# Altium project ESP32 Relay Card.PrjPcb
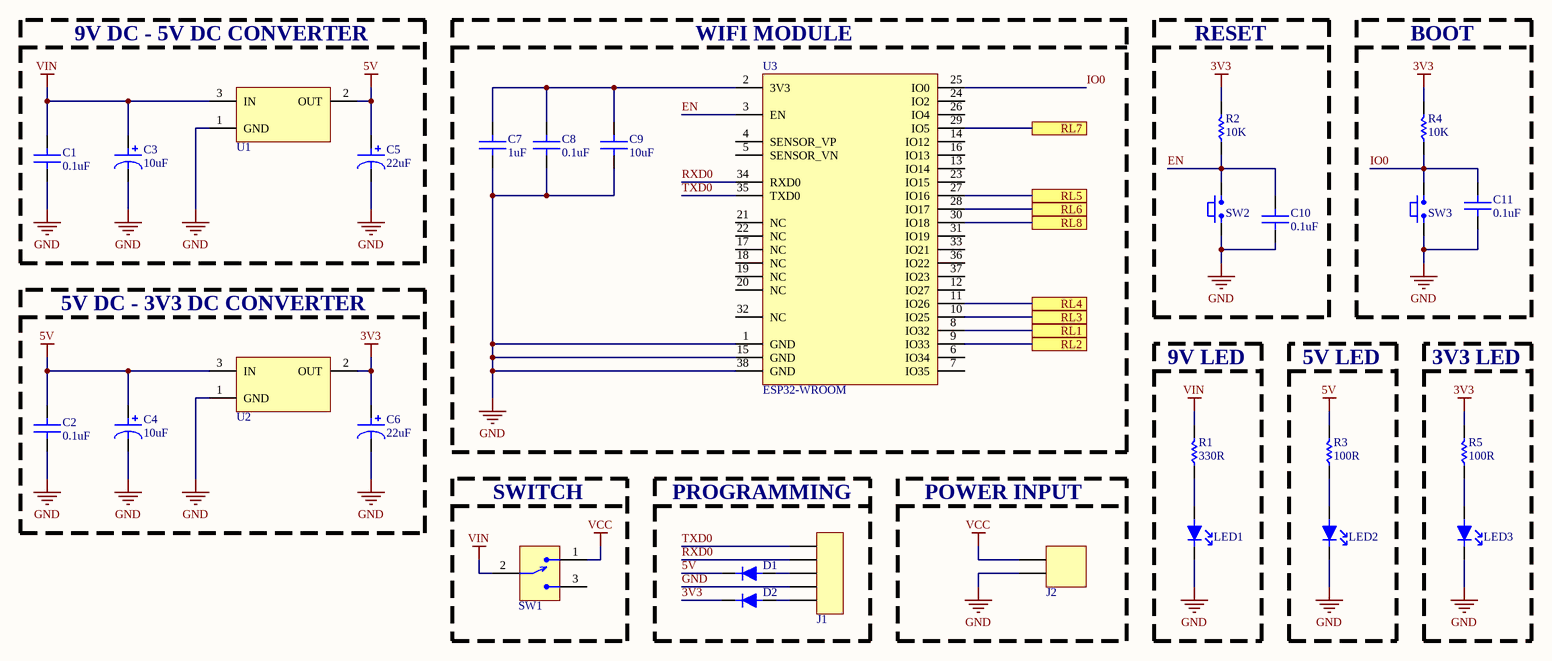
[diagram p0: ESP32 Relay Card Power.SchDoc]
2 sheets, 109 parts. Net scope: flat (ports and power ports of the same name join across sheets).
Board file: ESP32 Relay Card.PcbDoc
Sheets:
  ESP32 Relay Card Power.SchDoc
  ESP32 Relay Card Relay.SchDoc

## Sheet ESP32 Relay Card Power.SchDoc
size A3; SheetNumber: 1; SheetTotal: 2

### Parts
C1  value 0.1uF  [CAP 0805]  (hidden comment: CC0805KRX7R9BB104)
C2  value 0.1uF  [CAP 0805]  (hidden comment: CC0805KRX7R9BB104)
C3  value 10uF  [CAP ALUM 10UF]  (hidden comment: 875105359001)
C4  value 10uF  [CAP ALUM 10UF]  (hidden comment: 875105359001)
C5  value 22uF  [CAP ALUM 22UF]  (hidden comment: A766EB226M1DLAE060)
C6  value 22uF  [CAP ALUM 22UF]  (hidden comment: A766EB226M1DLAE060)
C7  value 1uF  [CAP 0805]  (hidden comment: CC0805KKX7R9BB105)
C8  value 0.1uF  [CAP 0805]  (hidden comment: CC0805KRX7R9BB104)
C9  value 10uF  [CAP 0805]  (hidden comment: CC0805KKX5R8BB106)
C10  value 0.1uF  [CAP 0805]  (hidden comment: CC0805KRX7R9BB104)
C11  value 0.1uF  [CAP 0805]  (hidden comment: CC0805KRX7R9BB104)
D1  1N5819W  [SOD-123F]  (value not drawn)
D2  1N5819W  [SOD-123F]  (value not drawn)
J1  61300511121  [HEADER]  (value not drawn)
J2  TB006-508-02BE  [2POS CONNECTOR]  (value not drawn)
LED1  150080VS75000  [LED 0805 SMD]  (value not drawn)
LED2  150080VS75000  [LED 0805 SMD]  (value not drawn)
LED3  150080VS75000  [LED 0805 SMD]  (value not drawn)
R1  value 330R  [RES 0603]  (hidden comment: CRGH0603F330R)
R2  value 10K  [RES 0603]  (hidden comment: CRGH0603J10K)
R3  value 100R  [RES 0603]  (hidden comment: CRGH0603J100R)
R4  value 10K  [RES 0603]  (hidden comment: CRGH0603J10K)
R5  value 100R  [RES 0603]  (hidden comment: CRGH0603J100R)
SW1  500SSP1S2M2QEA  [TACTICLE SWITCH TH]  (value not drawn)
SW2  PTS636SM43SMTR LFS  [TACTICLE SWITCH]  (value not drawn)
SW3  PTS636SM43SMTR LFS  [TACTICLE SWITCH]  (value not drawn)
U1  AMS1117-5.0  [SOT223]  (value not drawn)
U2  AMS1117-3.3  [SOT223]  (value not drawn)
U3  value ESP32-WROOM  [ESP32]  (hidden comment: ESP32-WROOM-32E-H4)

### Blocks framed on the sheet
9V DC - 5V DC CONVERTER: C1 C3 C5 U1
WIFI MODULE: C7-C9 U3
RESET: C10 R2 SW2
BOOT: C11 R4 SW3
5V DC - 3V3 DC CONVERTER: C2 C4 C6 U2
9V LED: LED1 R1
5V LED: LED2 R3
3V3 LED: LED3 R5
SWITCH: SW1
PROGRAMMING: D1 D2 J1
POWER INPUT: J2

### Ports
RL1 (see ESP32 Relay Card Relay[1A]), RL2 (see ESP32 Relay Card Relay[1B]), RL3 (see ESP32 Relay Card Relay[1C]), RL4 (see ESP32 Relay Card Relay[3A]), RL5 (see ESP32 Relay Card Relay[3B]), RL6 (see ESP32 Relay Card Relay[3C]), RL7 (see ESP32 Relay Card Relay[5A]), RL8 (see ESP32 Relay Card Relay[5B])

### Nets
3V3: C6.1 D2.2 R2.2 R4.2 R5.2 U2.2(OUT)
5V: C2.2 C4.1 C5.1 D1.2 R3.2 U1.2(OUT) U2.3(IN)
GND: C1.1 C2.1 C3.2 C4.2 C5.2 C6.2 C7.1 C8.1 C9.1 C10.1 C11.1 J1.4 J2.2 LED1.2 LED2.2 LED3.2 SW2.1 SW3.1 U1.1(GND) U2.1(GND) U3.1(GND) U3.15(GND) U3.38(GND)
VCC: J2.1 SW1.1
VIN: C1.2 C3.1 R1.2 SW1.2 U1.3(IN)
EN: C10.2 R2.1 SW2.2 U3.3(EN)
IO0: C11.2 R4.1 SW3.2 U3.25(IO0)
RXD0: J1.2 U3.34(RXD0)
TXD0: J1.1 U3.35(TXD0)
NetC7_2: C7.2 C8.2 C9.2 U3.2(3V3)
NetD1_1: D1.1 J1.3
NetD2_1: D2.1 J1.5
NetLED1_1: LED1.1 R1.1
NetLED2_1: LED2.1 R3.1
NetLED3_1: LED3.1 R5.1
NetR6_1: U3.8(IO32) ; port RL1
NetR7_1: U3.9(IO33) ; port RL2
NetR8_1: U3.10(IO25) ; port RL3
NetR17_1: U3.11(IO26) ; port RL4
NetR18_1: U3.27(IO16) ; port RL5
NetR19_1: U3.28(IO17) ; port RL6
NetR32_1: U3.29(IO5) ; port RL7
NetR33_1: U3.30(IO18) ; port RL8

Not connected (* = marked no-connect by the designer): SW1 3; U3 4(SENSOR_VP) 5(SENSOR_VN) 6(IO34) 7(IO35) 12(IO27) 13(IO14) 14(IO12) 16(IO13) 17(NC) 18(NC) 19(NC) 20(NC) 21(NC) 22(NC) 23(IO15) 24(IO2) 26(IO4) 31(IO19) 32(NC) 33(IO21) 36(IO22) 37(IO23)

### Notes on the sheet
- Dosya Adı / File Name
- Hazırlayan / Prepared By
- Tanım / Description
- Değiştirme Tarihi / Changed Date
- Bölüm / Department
- Onaylayan / Approved By
- Kontrol Eden / Checked By
- Boyut / Size
- Sayfa / Sheet
- Revizyon / Revision

### Library data of the parts
C1 C2 C8 C10 C11 = CAP CER 0.1UF 0805 SMD: CAP CER 0.1UF 50V X7R 0805
C3 C4 = CAP ALUM 10UF SMD: CAP ALUM 10UF 20% 16V SMD
C5 C6 = CAP ALUM 22UF SMD: CAP ALUM 22UF 20% 20V SMD
C7 = CAP CER 1UF 0805 SMD: CAP CER 1UF 50V X7R 0805
C9 = CAP CER 10UF 0805 SMD: CAP CER 10UF 25V X5R 0805
D1 D2 = SCHOTTKY DIODE SMD: DIODE SCHOTTKY 40V 1A SOD-123F
J1 = HEADER 5POS TH: CONN HEADER 5POS 2.54MM
J2 = 2POS CONNECTOR: TERM BLK 2P 5.08 PCB
LED1-LED3 = GREEN LED 0805 SMD: LED GREEN 0805 SMD
R1 = RES 330 OHM 0603 SMD: RES 330 OHM 1% 1/5W 0603
R2 R4 = RES 10K OHM 0603 SMD: RES 10K OHM 5% 1/5W 0603
R3 R5 = RES 100 OHM 0603 SMD: RES 100 OHM 5% 1/5W 0603
SW1 = SLIDE SWITCH TH: SWITCH SLIDE 5A 120V
SW2 SW3 = TACTILE SWITCH SMD: SWITCH TACTILE 0.05A 12V
U1 = LDO REG 5V 1A SMD: IC LDO REG 5V 1A SOT223
U2 = LDO REG 3V3 1A SMD: IC LDO REG 3.3V 1A SOT223
U3 = ESP32-WROOM-32E: RF TXRX MOD BT WIFI TH SMD

## Sheet ESP32 Relay Card Relay.SchDoc
size A3; SheetNumber: 2; SheetTotal: 2
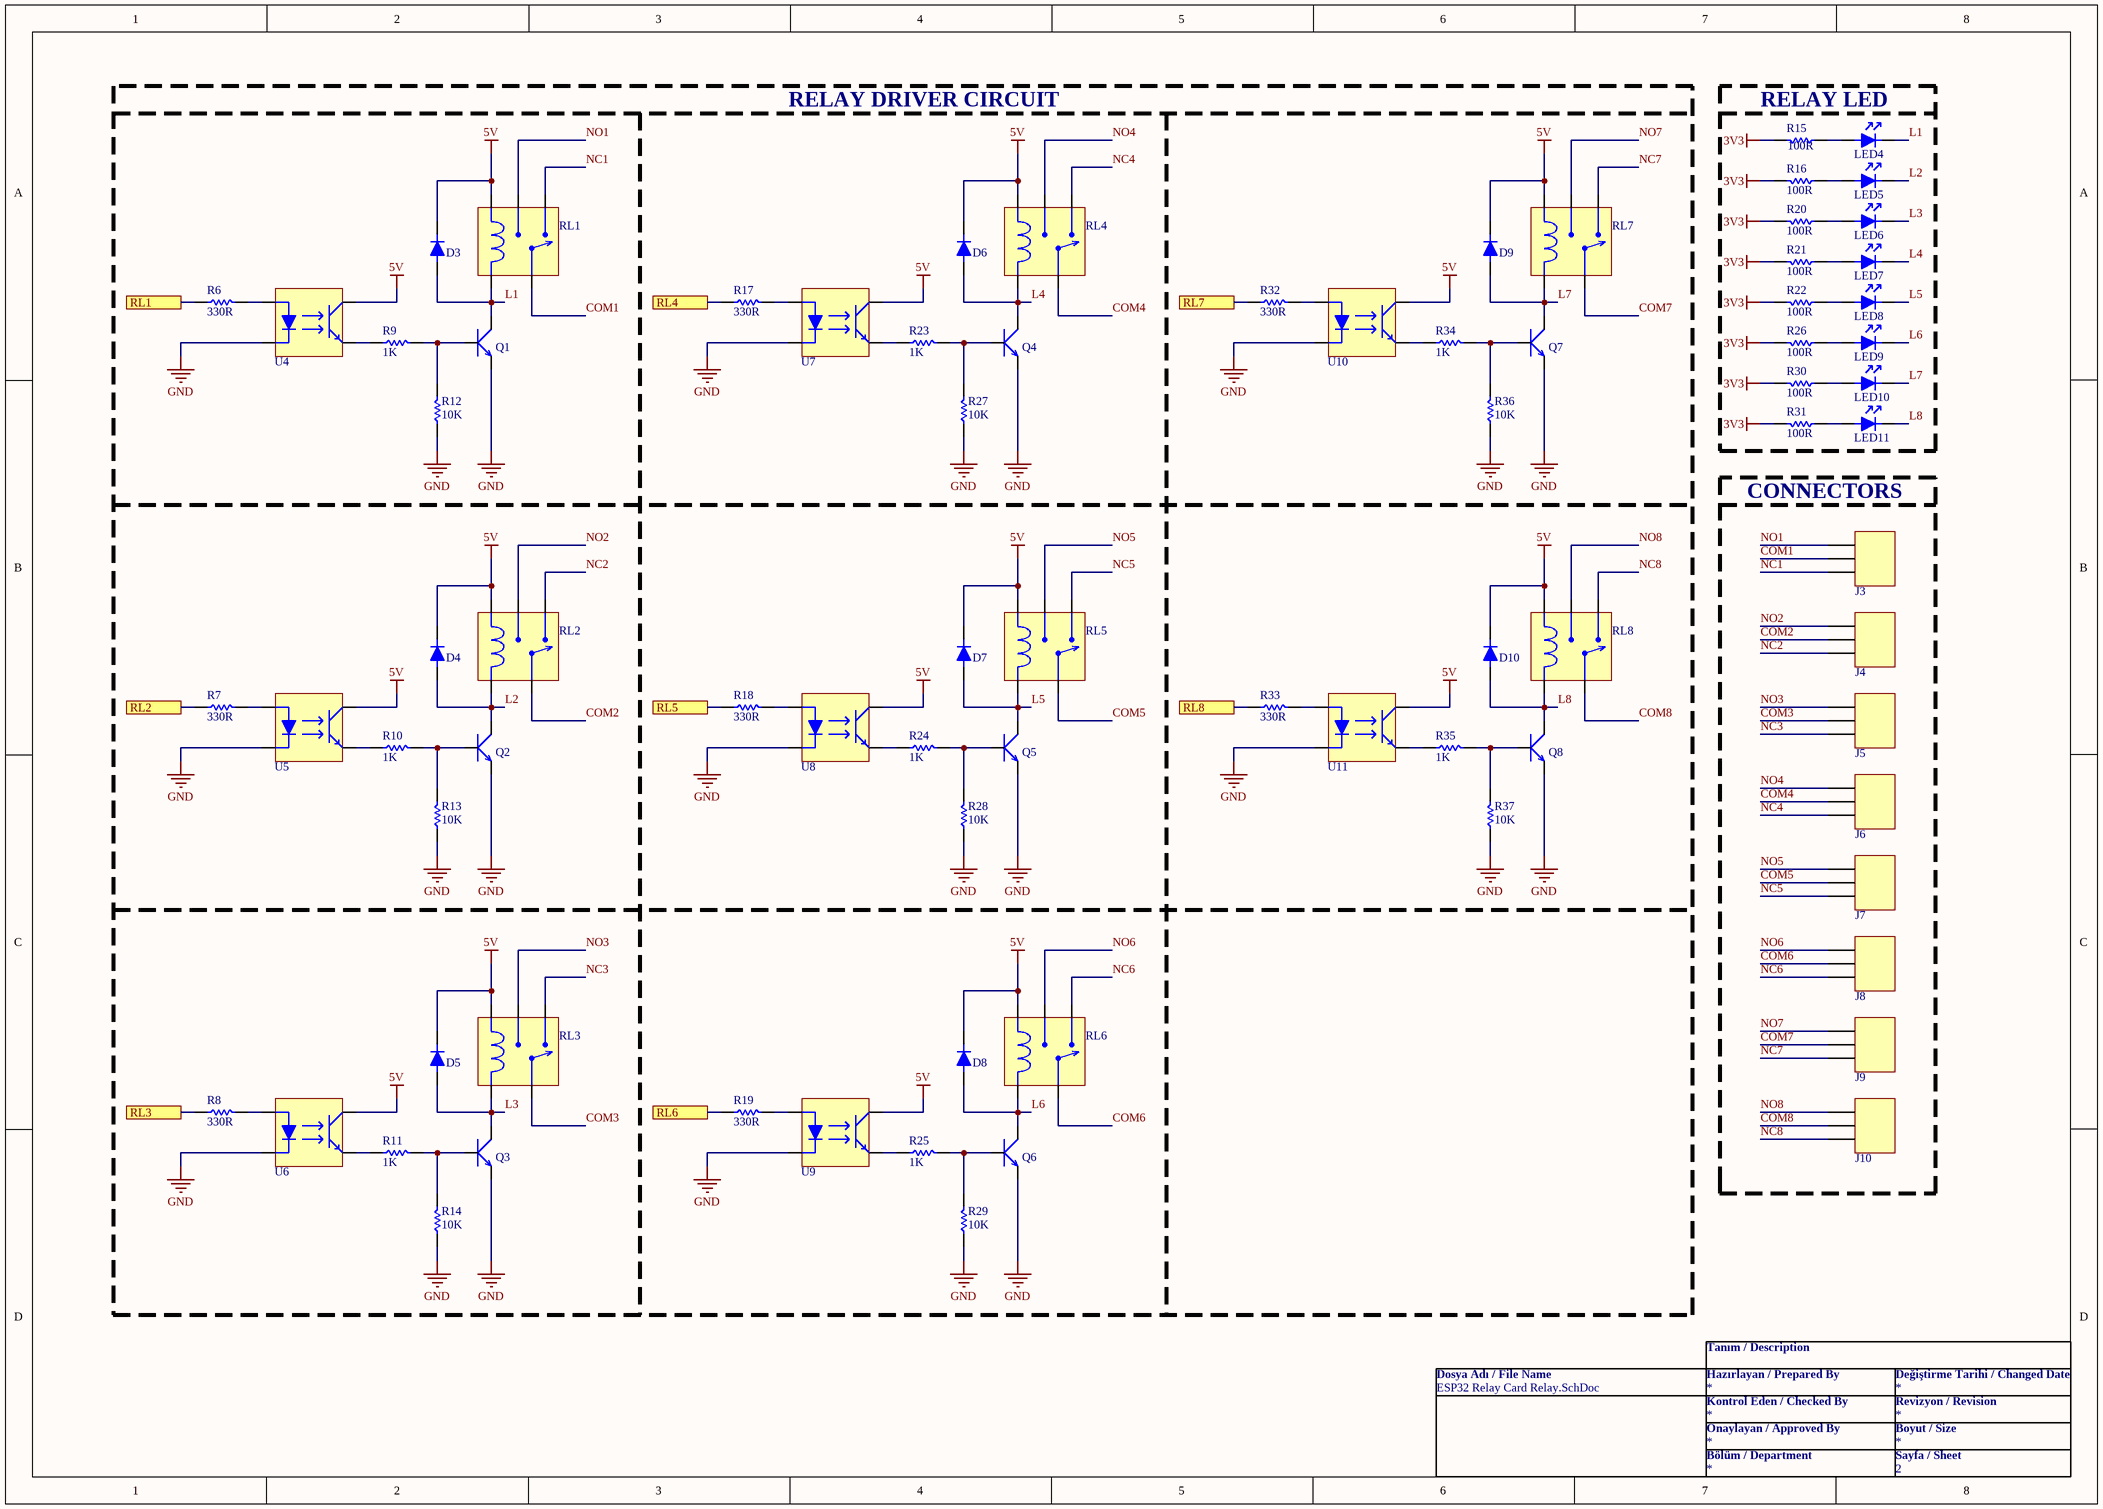
[diagram p1: ESP32 Relay Card Relay.SchDoc]

### Parts
D3  1N5819W  [SOD-123F]  (value not drawn)
D4  1N5819W  [SOD-123F]  (value not drawn)
D5  1N5819W  [SOD-123F]  (value not drawn)
D6  1N5819W  [SOD-123F]  (value not drawn)
D7  1N5819W  [SOD-123F]  (value not drawn)
D8  1N5819W  [SOD-123F]  (value not drawn)
D9  1N5819W  [SOD-123F]  (value not drawn)
D10  1N5819W  [SOD-123F]  (value not drawn)
J3  OSTTA034163  [3POS CONNECTOR]  (value not drawn)
J4  OSTTA034163  [3POS CONNECTOR]  (value not drawn)
J5  OSTTA034163  [3POS CONNECTOR]  (value not drawn)
J6  OSTTA034163  [3POS CONNECTOR]  (value not drawn)
J7  OSTTA034163  [3POS CONNECTOR]  (value not drawn)
J8  OSTTA034163  [3POS CONNECTOR]  (value not drawn)
J9  OSTTA034163  [3POS CONNECTOR]  (value not drawn)
J10  OSTTA034163  [3POS CONNECTOR]  (value not drawn)
LED4  150080VS75000  [LED 0805 SMD]  (value not drawn)
LED5  150080VS75000  [LED 0805 SMD]  (value not drawn)
LED6  150080VS75000  [LED 0805 SMD]  (value not drawn)
LED7  150080VS75000  [LED 0805 SMD]  (value not drawn)
LED8  150080VS75000  [LED 0805 SMD]  (value not drawn)
LED9  150080VS75000  [LED 0805 SMD]  (value not drawn)
LED10  150080VS75000  [LED 0805 SMD]  (value not drawn)
LED11  150080VS75000  [LED 0805 SMD]  (value not drawn)
Q1  MMBT3904-7-F  [SOT23-3]  (value not drawn)
Q2  MMBT3904-7-F  [SOT23-3]  (value not drawn)
Q3  MMBT3904-7-F  [SOT23-3]  (value not drawn)
Q4  MMBT3904-7-F  [SOT23-3]  (value not drawn)
Q5  MMBT3904-7-F  [SOT23-3]  (value not drawn)
Q6  MMBT3904-7-F  [SOT23-3]  (value not drawn)
Q7  MMBT3904-7-F  [SOT23-3]  (value not drawn)
Q8  MMBT3904-7-F  [SOT23-3]  (value not drawn)
R6  value 330R  [RES 0603]  (hidden comment: CRGH0603F330R)
R7  value 330R  [RES 0603]  (hidden comment: CRGH0603F330R)
R8  value 330R  [RES 0603]  (hidden comment: CRGH0603F330R)
R9  value 1K  [RES 0603]  (hidden comment: CRGH0603J1K0)
R10  value 1K  [RES 0603]  (hidden comment: CRGH0603J1K0)
R11  value 1K  [RES 0603]  (hidden comment: CRGH0603J1K0)
R12  value 10K  [RES 0603]  (hidden comment: CRGH0603J10K)
R13  value 10K  [RES 0603]  (hidden comment: CRGH0603J10K)
R14  value 10K  [RES 0603]  (hidden comment: CRGH0603J10K)
R15  value 100R  [RES 0603]  (hidden comment: CRGH0603J100R)
R16  value 100R  [RES 0603]  (hidden comment: CRGH0603J100R)
R17  value 330R  [RES 0603]  (hidden comment: CRGH0603F330R)
R18  value 330R  [RES 0603]  (hidden comment: CRGH0603F330R)
R19  value 330R  [RES 0603]  (hidden comment: CRGH0603F330R)
R20  value 100R  [RES 0603]  (hidden comment: CRGH0603J100R)
R21  value 100R  [RES 0603]  (hidden comment: CRGH0603J100R)
R22  value 100R  [RES 0603]  (hidden comment: CRGH0603J100R)
R23  value 1K  [RES 0603]  (hidden comment: CRGH0603J1K0)
R24  value 1K  [RES 0603]  (hidden comment: CRGH0603J1K0)
R25  value 1K  [RES 0603]  (hidden comment: CRGH0603J1K0)
R26  value 100R  [RES 0603]  (hidden comment: CRGH0603J100R)
R27  value 10K  [RES 0603]  (hidden comment: CRGH0603J10K)
R28  value 10K  [RES 0603]  (hidden comment: CRGH0603J10K)
R29  value 10K  [RES 0603]  (hidden comment: CRGH0603J10K)
R30  value 100R  [RES 0603]  (hidden comment: CRGH0603J100R)
R31  value 100R  [RES 0603]  (hidden comment: CRGH0603J100R)
R32  value 330R  [RES 0603]  (hidden comment: CRGH0603F330R)
R33  value 330R  [RES 0603]  (hidden comment: CRGH0603F330R)
R34  value 1K  [RES 0603]  (hidden comment: CRGH0603J1K0)
R35  value 1K  [RES 0603]  (hidden comment: CRGH0603J1K0)
R36  value 10K  [RES 0603]  (hidden comment: CRGH0603J10K)
R37  value 10K  [RES 0603]  (hidden comment: CRGH0603J10K)
RL1  G5LE-1 DC5  [RELAY]  (value not drawn)
RL2  G5LE-1 DC5  [RELAY]  (value not drawn)
RL3  G5LE-1 DC5  [RELAY]  (value not drawn)
RL4  G5LE-1 DC5  [RELAY]  (value not drawn)
RL5  G5LE-1 DC5  [RELAY]  (value not drawn)
RL6  G5LE-1 DC5  [RELAY]  (value not drawn)
RL7  G5LE-1 DC5  [RELAY]  (value not drawn)
RL8  G5LE-1 DC5  [RELAY]  (value not drawn)
U4  APC-817B1-SL  [OPTOISOLATOR]  (value not drawn)
U5  APC-817B1-SL  [OPTOISOLATOR]  (value not drawn)
U6  APC-817B1-SL  [OPTOISOLATOR]  (value not drawn)
U7  APC-817B1-SL  [OPTOISOLATOR]  (value not drawn)
U8  APC-817B1-SL  [OPTOISOLATOR]  (value not drawn)
U9  APC-817B1-SL  [OPTOISOLATOR]  (value not drawn)
U10  APC-817B1-SL  [OPTOISOLATOR]  (value not drawn)
U11  APC-817B1-SL  [OPTOISOLATOR]  (value not drawn)

### Blocks framed on the sheet
RELAY DRIVER CIRCUIT: D3-D10 Q1-Q8 R6-R14 R17-R19 R23-R25 R27-R29 R32-R37 RL1-RL8 U4-U11
RELAY LED: LED4-LED11 R15 R16 R20-R22 R26 R30 R31

### Ports
RL1 (see ESP32 Relay Card Power[5B]), RL2 (see ESP32 Relay Card Power[5B]), RL3 (see ESP32 Relay Card Power[5B]), RL4 (see ESP32 Relay Card Power[5B]), RL5 (see ESP32 Relay Card Power[5A]), RL6 (see ESP32 Relay Card Power[5A]), RL7 (see ESP32 Relay Card Power[5A]), RL8 (see ESP32 Relay Card Power[5A])

### Nets
3V3: R15.2 R16.2 R20.2 R21.2 R22.2 R26.2 R30.2 R31.2
5V: D3.2 D4.2 D5.2 D6.2 D7.2 D8.2 D9.2 D10.2 RL1.2 RL2.2 RL3.2 RL4.2 RL5.2 RL6.2 RL7.2 RL8.2 U4.4 U5.4 U6.4 U7.4 U8.4 U9.4 U10.4 U11.4
GND: Q1.2 Q2.2 Q3.2 Q4.2 Q5.2 Q6.2 Q7.2 Q8.2 R12.1 R13.1 R14.1 R27.1 R28.1 R29.1 R36.1 R37.1 U4.2 U5.2 U6.2 U7.2 U8.2 U9.2 U10.2 U11.2
COM1: J3.2 RL1.1
COM2: J4.2 RL2.1
COM3: J5.2 RL3.1
COM4: J6.2 RL4.1
COM5: J7.2 RL5.1
COM6: J8.2 RL6.1
COM7: J9.2 RL7.1
COM8: J10.2 RL8.1
L1: D3.1 LED4.2 Q1.3 RL1.5
L2: D4.1 LED5.2 Q2.3 RL2.5
L3: D5.1 LED6.2 Q3.3 RL3.5
L4: D6.1 LED7.2 Q4.3 RL4.5
L5: D7.1 LED8.2 Q5.3 RL5.5
L6: D8.1 LED9.2 Q6.3 RL6.5
L7: D9.1 LED10.2 Q7.3 RL7.5
L8: D10.1 LED11.2 Q8.3 RL8.5
NC1: J3.3 RL1.4
NC2: J4.3 RL2.4
NC3: J5.3 RL3.4
NC4: J6.3 RL4.4
NC5: J7.3 RL5.4
NC6: J8.3 RL6.4
NC7: J9.3 RL7.4
NC8: J10.3 RL8.4
NO1: J3.1 RL1.3
NO2: J4.1 RL2.3
NO3: J5.1 RL3.3
NO4: J6.1 RL4.3
NO5: J7.1 RL5.3
NO6: J8.1 RL6.3
NO7: J9.1 RL7.3
NO8: J10.1 RL8.3
NetLED4_1: LED4.1 R15.1
NetLED5_1: LED5.1 R16.1
NetLED6_1: LED6.1 R20.1
NetLED7_1: LED7.1 R21.1
NetLED8_1: LED8.1 R22.1
NetLED9_1: LED9.1 R26.1
NetLED10_1: LED10.1 R30.1
NetLED11_1: LED11.1 R31.1
NetQ1_1: Q1.1 R9.2 R12.2
NetQ2_1: Q2.1 R10.2 R13.2
NetQ3_1: Q3.1 R11.2 R14.2
NetQ4_1: Q4.1 R23.2 R27.2
NetQ5_1: Q5.1 R24.2 R28.2
NetQ6_1: Q6.1 R25.2 R29.2
NetQ7_1: Q7.1 R34.2 R36.2
NetQ8_1: Q8.1 R35.2 R37.2
NetR6_1: R6.1 ; port RL1
NetR6_2: R6.2 U4.1
NetR7_1: R7.1 ; port RL2
NetR7_2: R7.2 U5.1
NetR8_1: R8.1 ; port RL3
NetR8_2: R8.2 U6.1
NetR9_1: R9.1 U4.3
NetR10_1: R10.1 U5.3
NetR11_1: R11.1 U6.3
NetR17_1: R17.1 ; port RL4
NetR17_2: R17.2 U7.1
NetR18_1: R18.1 ; port RL5
NetR18_2: R18.2 U8.1
NetR19_1: R19.1 ; port RL6
NetR19_2: R19.2 U9.1
NetR23_1: R23.1 U7.3
NetR24_1: R24.1 U8.3
NetR25_1: R25.1 U9.3
NetR32_1: R32.1 ; port RL7
NetR32_2: R32.2 U10.1
NetR33_1: R33.1 ; port RL8
NetR33_2: R33.2 U11.1
NetR34_1: R34.1 U10.3
NetR35_1: R35.1 U11.3

### Notes on the sheet
- CONNECTORS
- Dosya Adı / File Name
- Hazırlayan / Prepared By
- Tanım / Description
- Değiştirme Tarihi / Changed Date
- Bölüm / Department
- Onaylayan / Approved By
- Kontrol Eden / Checked By
- Boyut / Size
- Sayfa / Sheet
- Revizyon / Revision

### Library data of the parts
D3-D10 = SCHOTTKY DIODE SMD: DIODE SCHOTTKY 40V 1A SOD-123F
J3-J10 = 3POS CONNECTOR: TERM BLK 3P 5.08MM PCB
LED4-LED11 = GREEN LED 0805 SMD: LED GREEN 0805 SMD
Q1-Q8 = NPN TRANSISTOR SMD: TRANS NPN 40V 0.2A SOT23-3
R6-R8 R17-R19 R32 R33 = RES 330 OHM 0603 SMD: RES 330 OHM 1% 1/5W 0603
R9-R11 R23-R25 R34 R35 = RES 1K OHM 0603 SMD: RES 1K OHM 5% 1/5W 0603
R12-R14 R27-R29 R36 R37 = RES 10K OHM 0603 SMD: RES 10K OHM 5% 1/5W 0603
R15 R16 R20-R22 R26 R30 R31 = RES 100 OHM 0603 SMD: RES 100 OHM 5% 1/5W 0603
RL1-RL8 = RELAY TH: RELAY 5VDC COIL 10A
U4-U11 = OPTOCOUPLER SMD: OPTOISOLATOR 5KV 1CH SMD

## Nets that join several sheets
3V3: ESP32 Relay Card Power (6 pins), ESP32 Relay Card Relay (8 pins)
5V: ESP32 Relay Card Power (7 pins), ESP32 Relay Card Relay (24 pins)
GND: ESP32 Relay Card Power (23 pins), ESP32 Relay Card Relay (24 pins)
NetR6_1: ESP32 Relay Card Power (U3.8), ESP32 Relay Card Relay (R6.1)
NetR7_1: ESP32 Relay Card Power (U3.9), ESP32 Relay Card Relay (R7.1)
NetR8_1: ESP32 Relay Card Power (U3.10), ESP32 Relay Card Relay (R8.1)
NetR17_1: ESP32 Relay Card Power (U3.11), ESP32 Relay Card Relay (R17.1)
NetR18_1: ESP32 Relay Card Power (U3.27), ESP32 Relay Card Relay (R18.1)
NetR19_1: ESP32 Relay Card Power (U3.28), ESP32 Relay Card Relay (R19.1)
NetR32_1: ESP32 Relay Card Power (U3.29), ESP32 Relay Card Relay (R32.1)
NetR33_1: ESP32 Relay Card Power (U3.30), ESP32 Relay Card Relay (R33.1)